# EAGLE schematic 5_8GHzRadar (EAGLE 9.5.2)

## Sheet 1 of 6
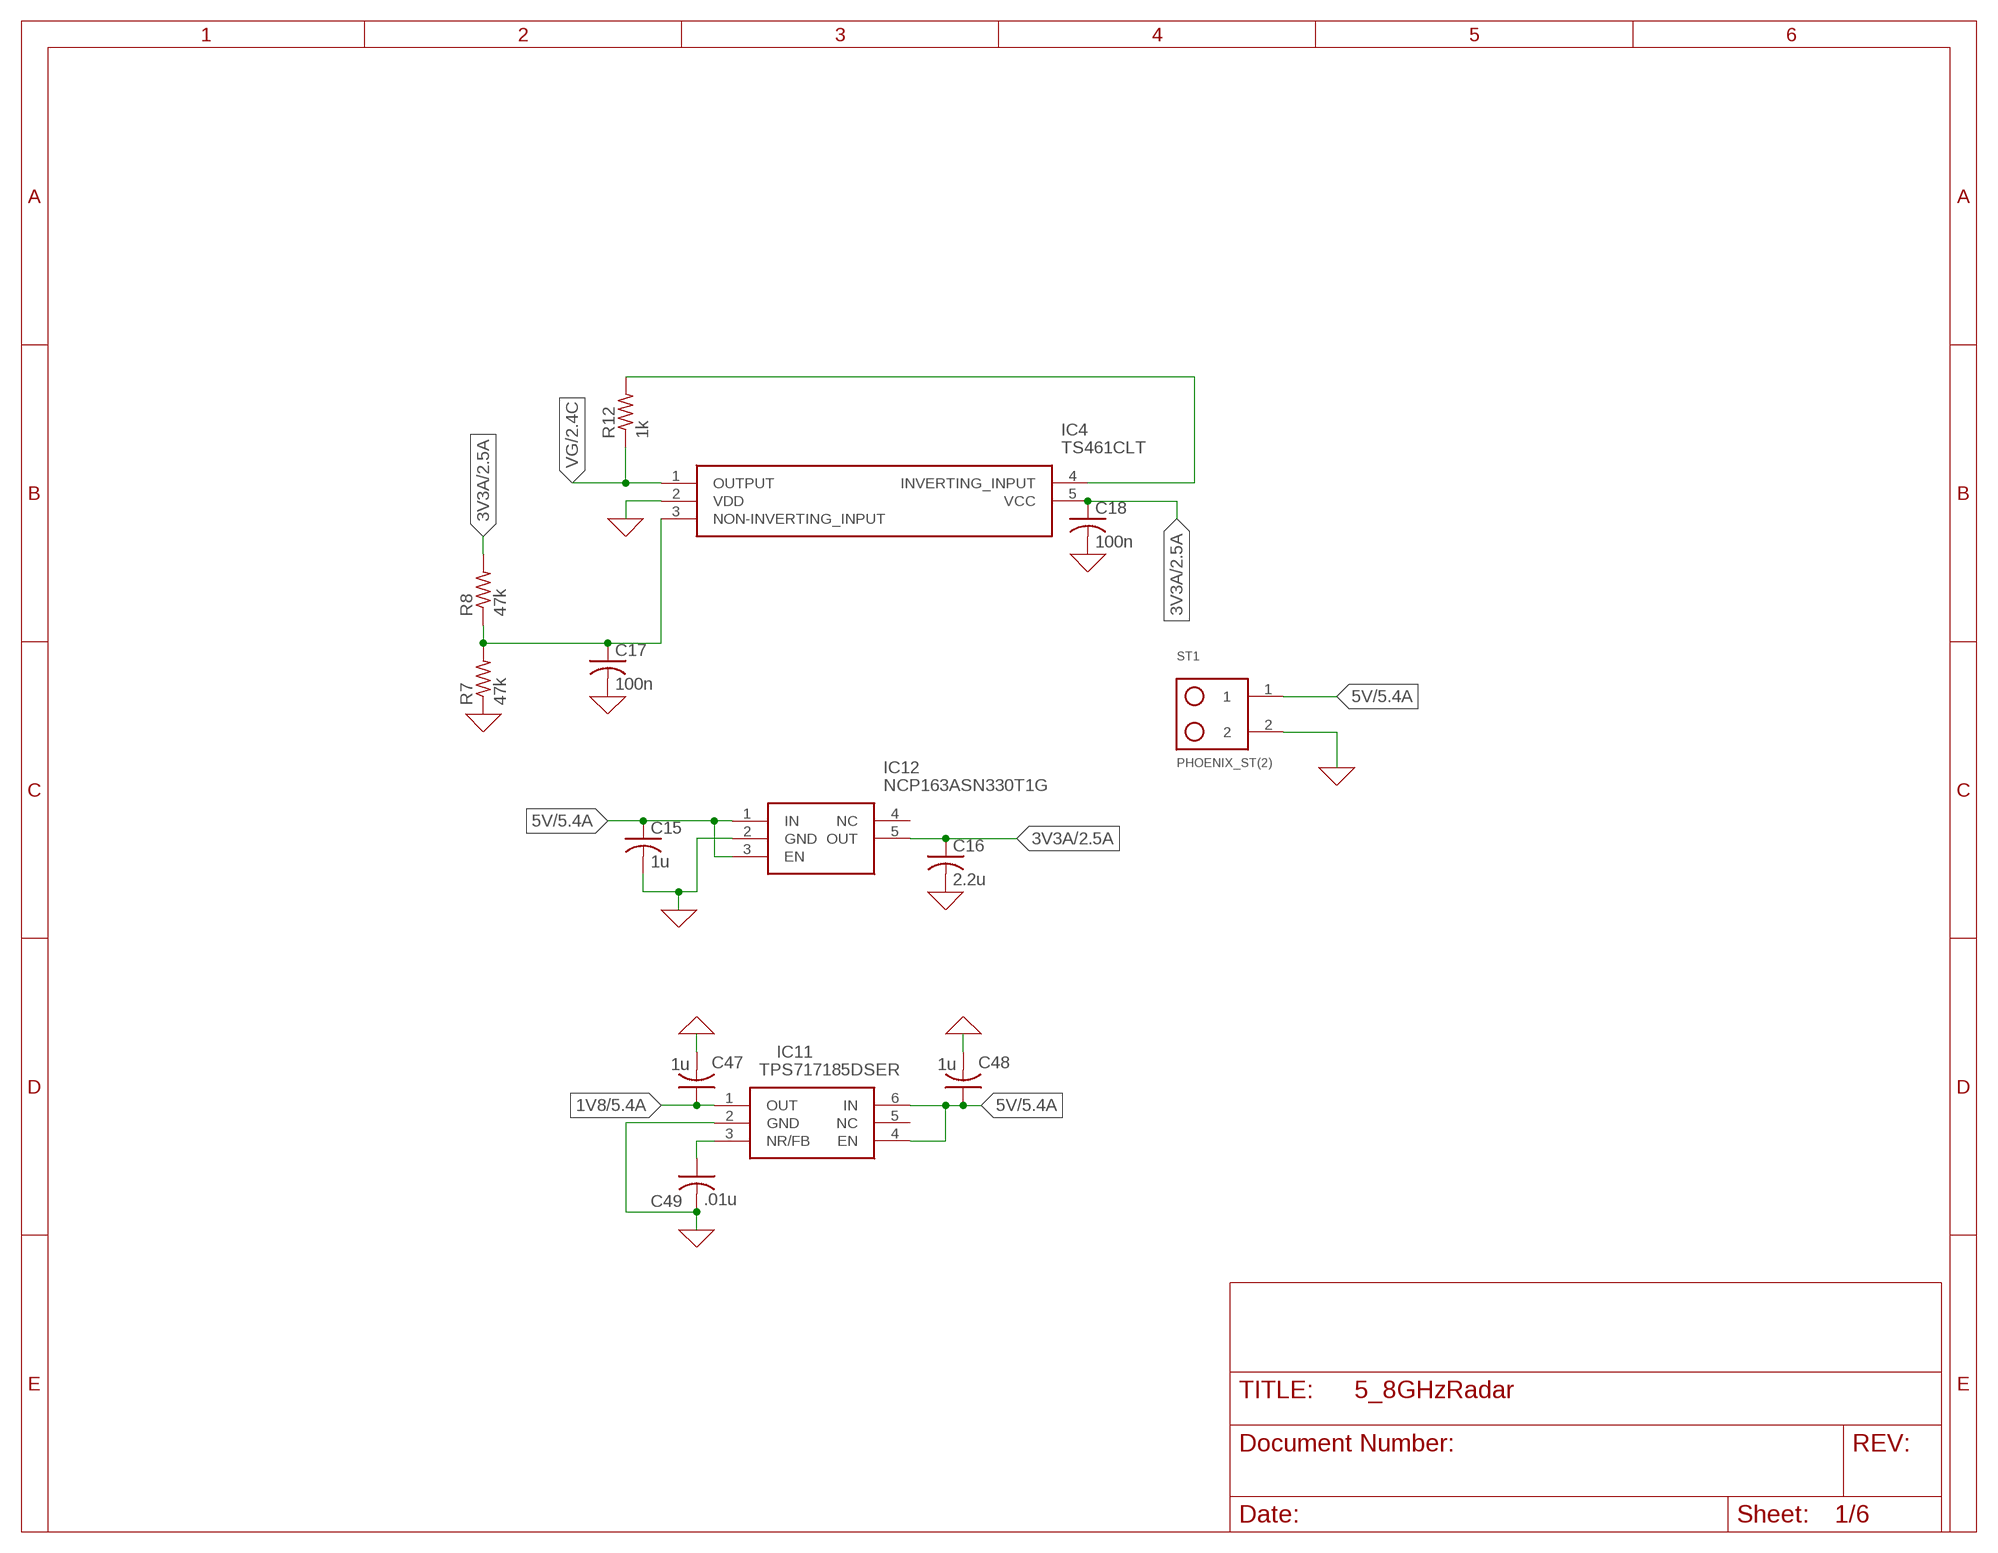
[diagram p0: schematic, sheet 1]

### Parts
C15  1u  C-USC0805  [C0805]
C16  2.2u  C-USC0805  [C0805]
C17  100n  C-USC0805  [C0805]
C18  100n  C-USC0805  [C0805]
C47  1u  C-USC0805  [C0805]
C48  1u  C-USC0805  [C0805]
C49  .01u  C-USC0805  [C0805]
IC4  TS461CLT  [SOT95P280X145-5N@1]
IC11  TPS717185DSER  [SON50P150X150X80-6N]
IC12  NCP163ASN330T1G  [SOT95P280X145-5N]
R7  47k  R-US_R0805  [R0805]
R8  47k  R-US_R0805  [R0805]
R12  1k  R-US_R0805  [R0805]
ST1  PHOENIX_ST(2)  [PHEONIX_SCREW(2)]

### Nets
0: C15.2 C16.2 C17.2 C18.2 C47.2 C48.2 C49.2 IC4.2(VDD) IC11.2(GND) IC12.2(GND) R7.1 ST1.2 ; supply symbol labelled GND ; also sheet 2,3,4,5
1V8: C47.1 IC11.1(OUT) ; also sheet 5
3V3A: C16.1 C18.1 IC4.5(VCC) IC12.5(OUT) R8.2 ; also sheet 2,3,4,5
5V: C15.1 C48.1 IC11.4(EN) IC11.6(IN) IC12.1(IN) IC12.3(EN) ST1.1 ; also sheet 5
N$8: C17.1 IC4.3(NON-INVERTING_INPUT) R7.2 R8.1
N$17: IC4.4(INVERTING_INPUT) R12.2
N$46: C49.1 IC11.3(NR/FB)
VG: IC4.1(OUTPUT) R12.1 ; also sheet 2,3,4
Unconnected: IC11.5(NC) IC12.4(NC)

## Sheet 2 of 6
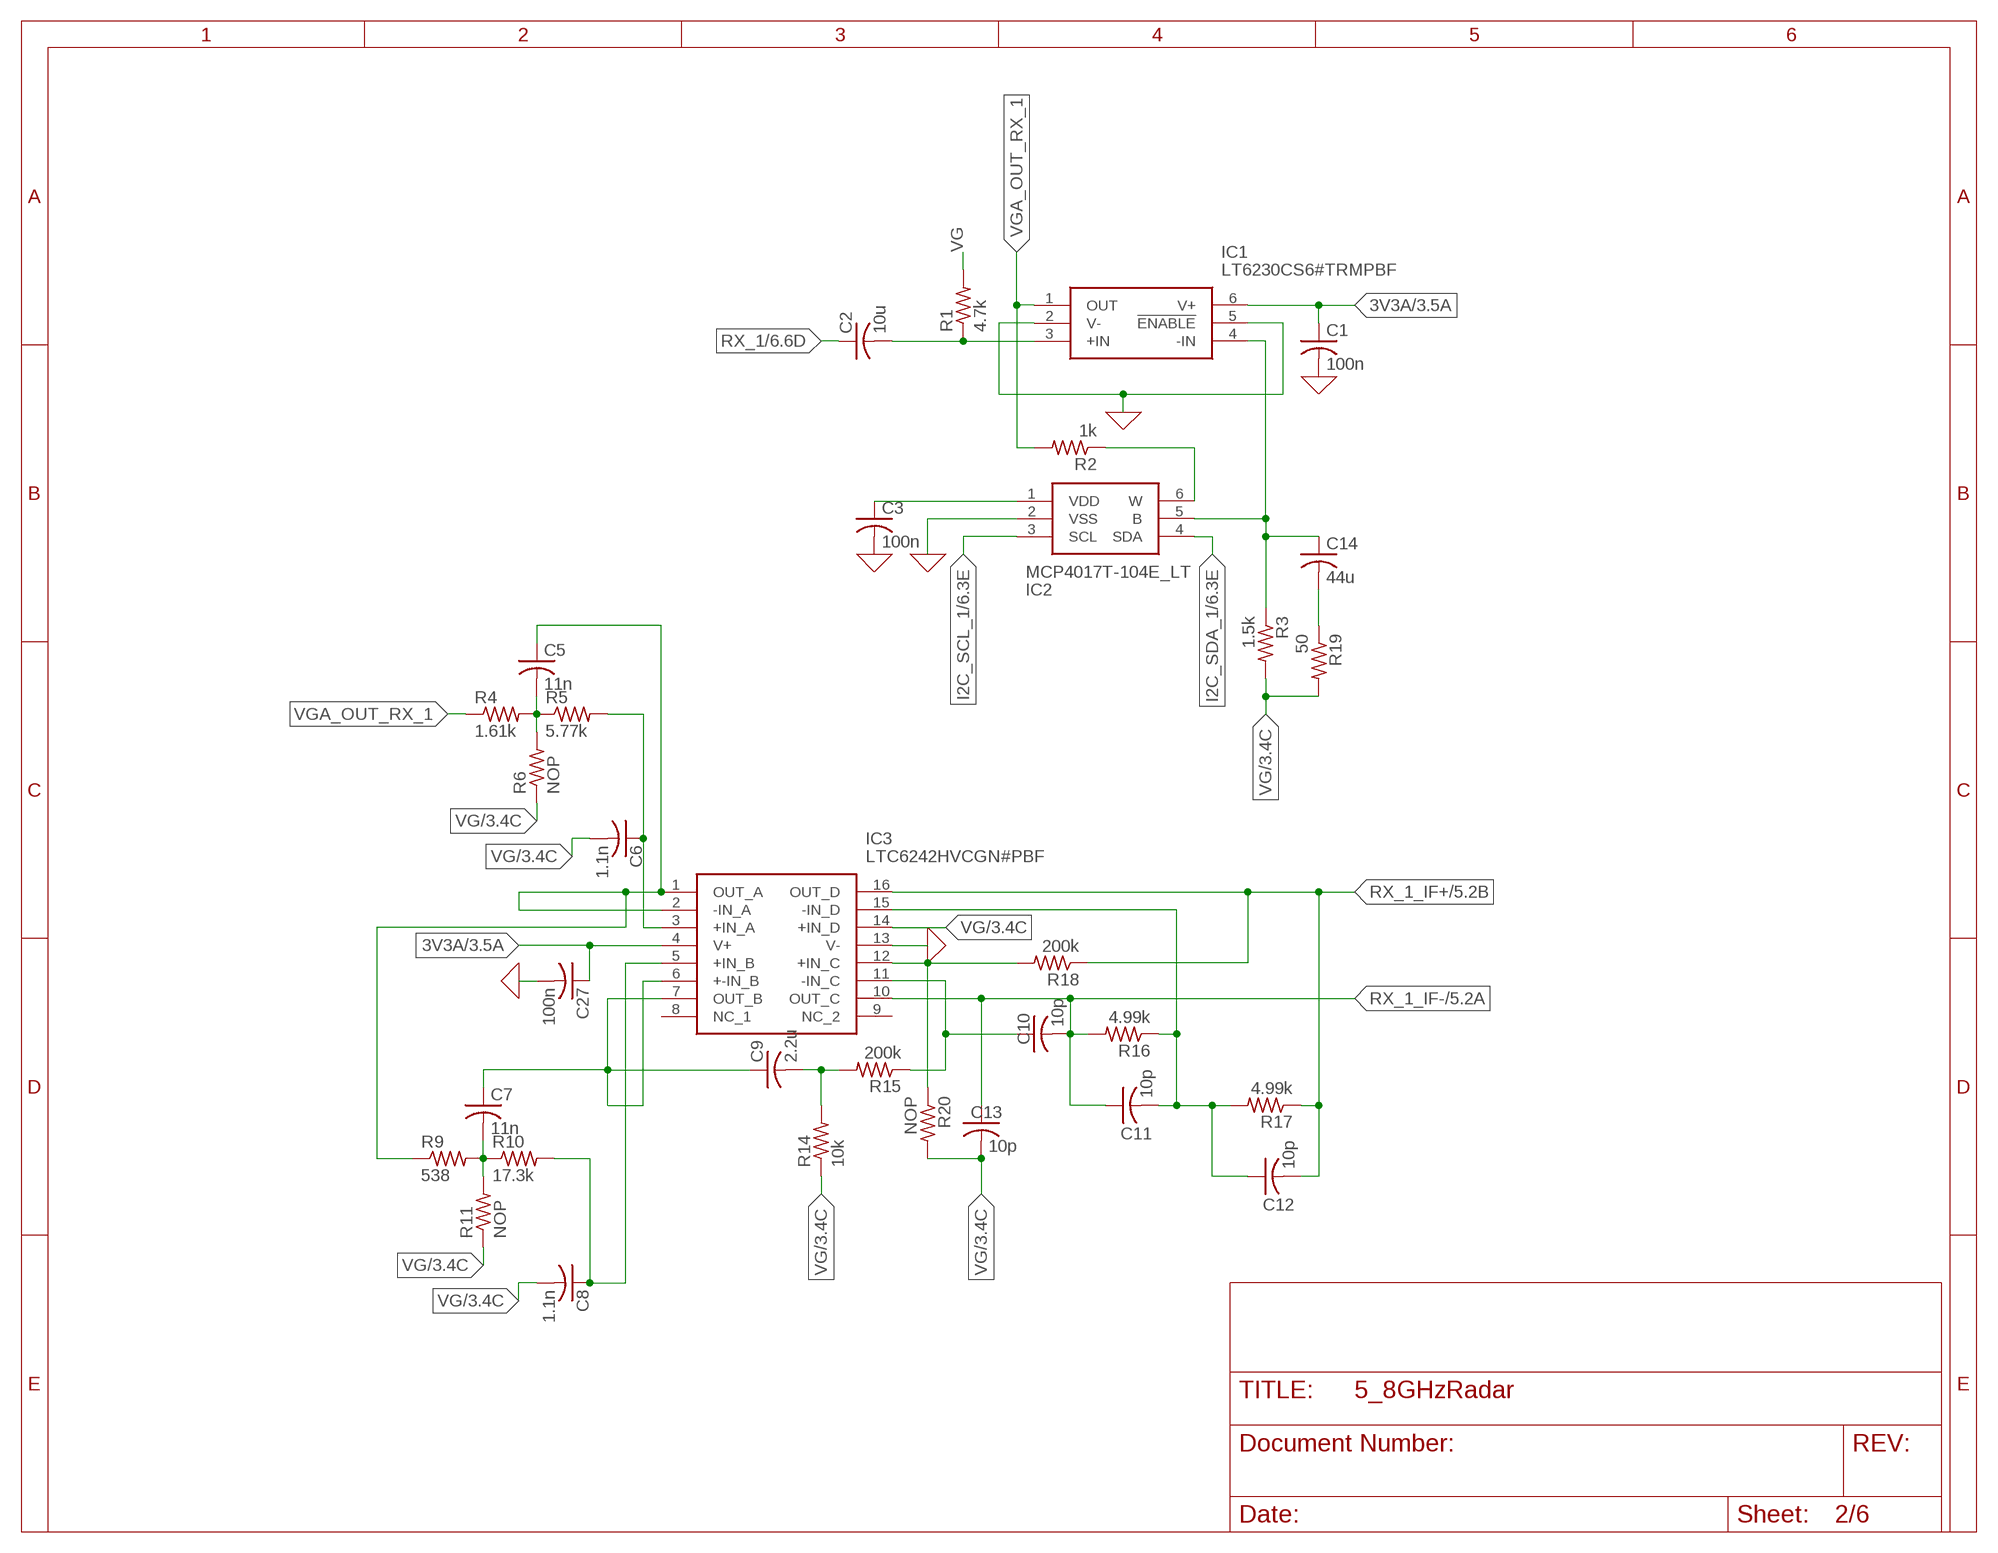
[diagram p1: schematic, sheet 2]

### Parts
C1  100n  C-USC0805  [C0805]
C2  10u  C-USC0805  [C0805]
C3  100n  C-USC0805  [C0805]
C5  11n  C-USC0805  [C0805]
C6  1.1n  C-USC0805  [C0805]
C7  11n  C-USC0805  [C0805]
C8  1.1n  C-USC0805  [C0805]
C9  2.2u  C-USC0805  [C0805]
C10  10p  C-USC0805  [C0805]
C11  10p  C-USC0805  [C0805]
C12  10p  C-USC0805  [C0805]
C13  10p  C-USC0805  [C0805]
C14  44u  C-USC0603  [C0603]
C27  100n  C-USC0805  [C0805]
IC1  LT6230CS6#TRMPBF  [SOT95P280X100-6N]
IC2  MCP4017T-104E_LT  [SOT65P210X110-6N]
IC3  LTC6242HVCGN#PBF  [SOP64P601X175-16N]
R1  4.7k  R-US_R0805  [R0805]
R2  1k  R-US_R0805  [R0805]
R3  1.5k  R-US_R0805  [R0805]
R4  1.61k  R-US_R0805  [R0805]
R5  5.77k  R-US_R0805  [R0805]
R6  NOP  R-US_R0805  [R0805]
R9  538  R-US_R0805  [R0805]
R10  17.3k  R-US_R0805  [R0805]
R11  NOP  R-US_R0805  [R0805]
R14  10k  R-US_R0805  [R0805]
R15  200k  R-US_R0805  [R0805]
R16  4.99k  R-US_R0805  [R0805]
R17  4.99k  R-US_R0805  [R0805]
R18  200k  R-US_R0805  [R0805]
R19  50  R-US_R0805  [R0805]
R20  NOP  R-US_R0805  [R0805]

### Nets
0: C1.2 C3.2 C27.2 IC1.2(V-) IC1.5(!ENABLE) IC2.2(VSS) IC3.13(V-) ; supply symbol labelled GND ; also sheet 1,3,4,5
3V3A: C1.1 C27.1 IC1.6(V+) IC3.4(V+) ; also sheet 1,3,4,5
FILTER1: C5.1 IC3.1(OUT_A) IC3.2(-IN_A) R9.1
I2C_SCL_1: IC2.3(SCL) ; also sheet 6
I2C_SDA_1: IC2.4(SDA) ; also sheet 6
N$1: C14.1 IC1.4(-IN) IC2.5(B) R3.1
N$2: C2.2 IC1.3(+IN) R1.1
N$3: C5.2 R4.2 R5.1 R6.2
N$4: IC2.6(W) R2.1
N$5: C3.1 IC2.1(VDD)
N$6: C9.2 R14.2 R15.2
N$7: C6.1 IC3.3(+IN_A) R5.2
N$9: C7.2 R9.2 R10.1 R11.2
N$11: C8.1 IC3.5(+IN_B) R10.2
N$12: C7.1 C9.1 IC3.6(+-IN_B) IC3.7(OUT_B)
N$13: C10.1 IC3.11(-IN_C) R15.1
N$14: C14.2 R19.1
N$15: IC3.12(+IN_C) R18.2 R20.1
N$18: C11.2 C12.1 IC3.15(-IN_D) R16.1 R17.2
RX_1: C2.1 ; also sheet 6
RX_1_IF+: C12.2 IC3.16(OUT_D) R17.1 R18.1 ; also sheet 5,6
RX_1_IF-: C10.2 C11.1 C13.1 IC3.10(OUT_C) R16.2 ; also sheet 5,6
VG: C6.2 C8.2 C13.2 IC3.14(+IN_D) R1.2 R3.2 R6.1 R11.1 R14.1 R19.2 R20.2 ; also sheet 1,3,4
VGA_OUT_RX_1: IC1.1(OUT) R2.2 R4.1
Unconnected: IC3.8(NC_1) IC3.9(NC_2)

## Sheet 3 of 6
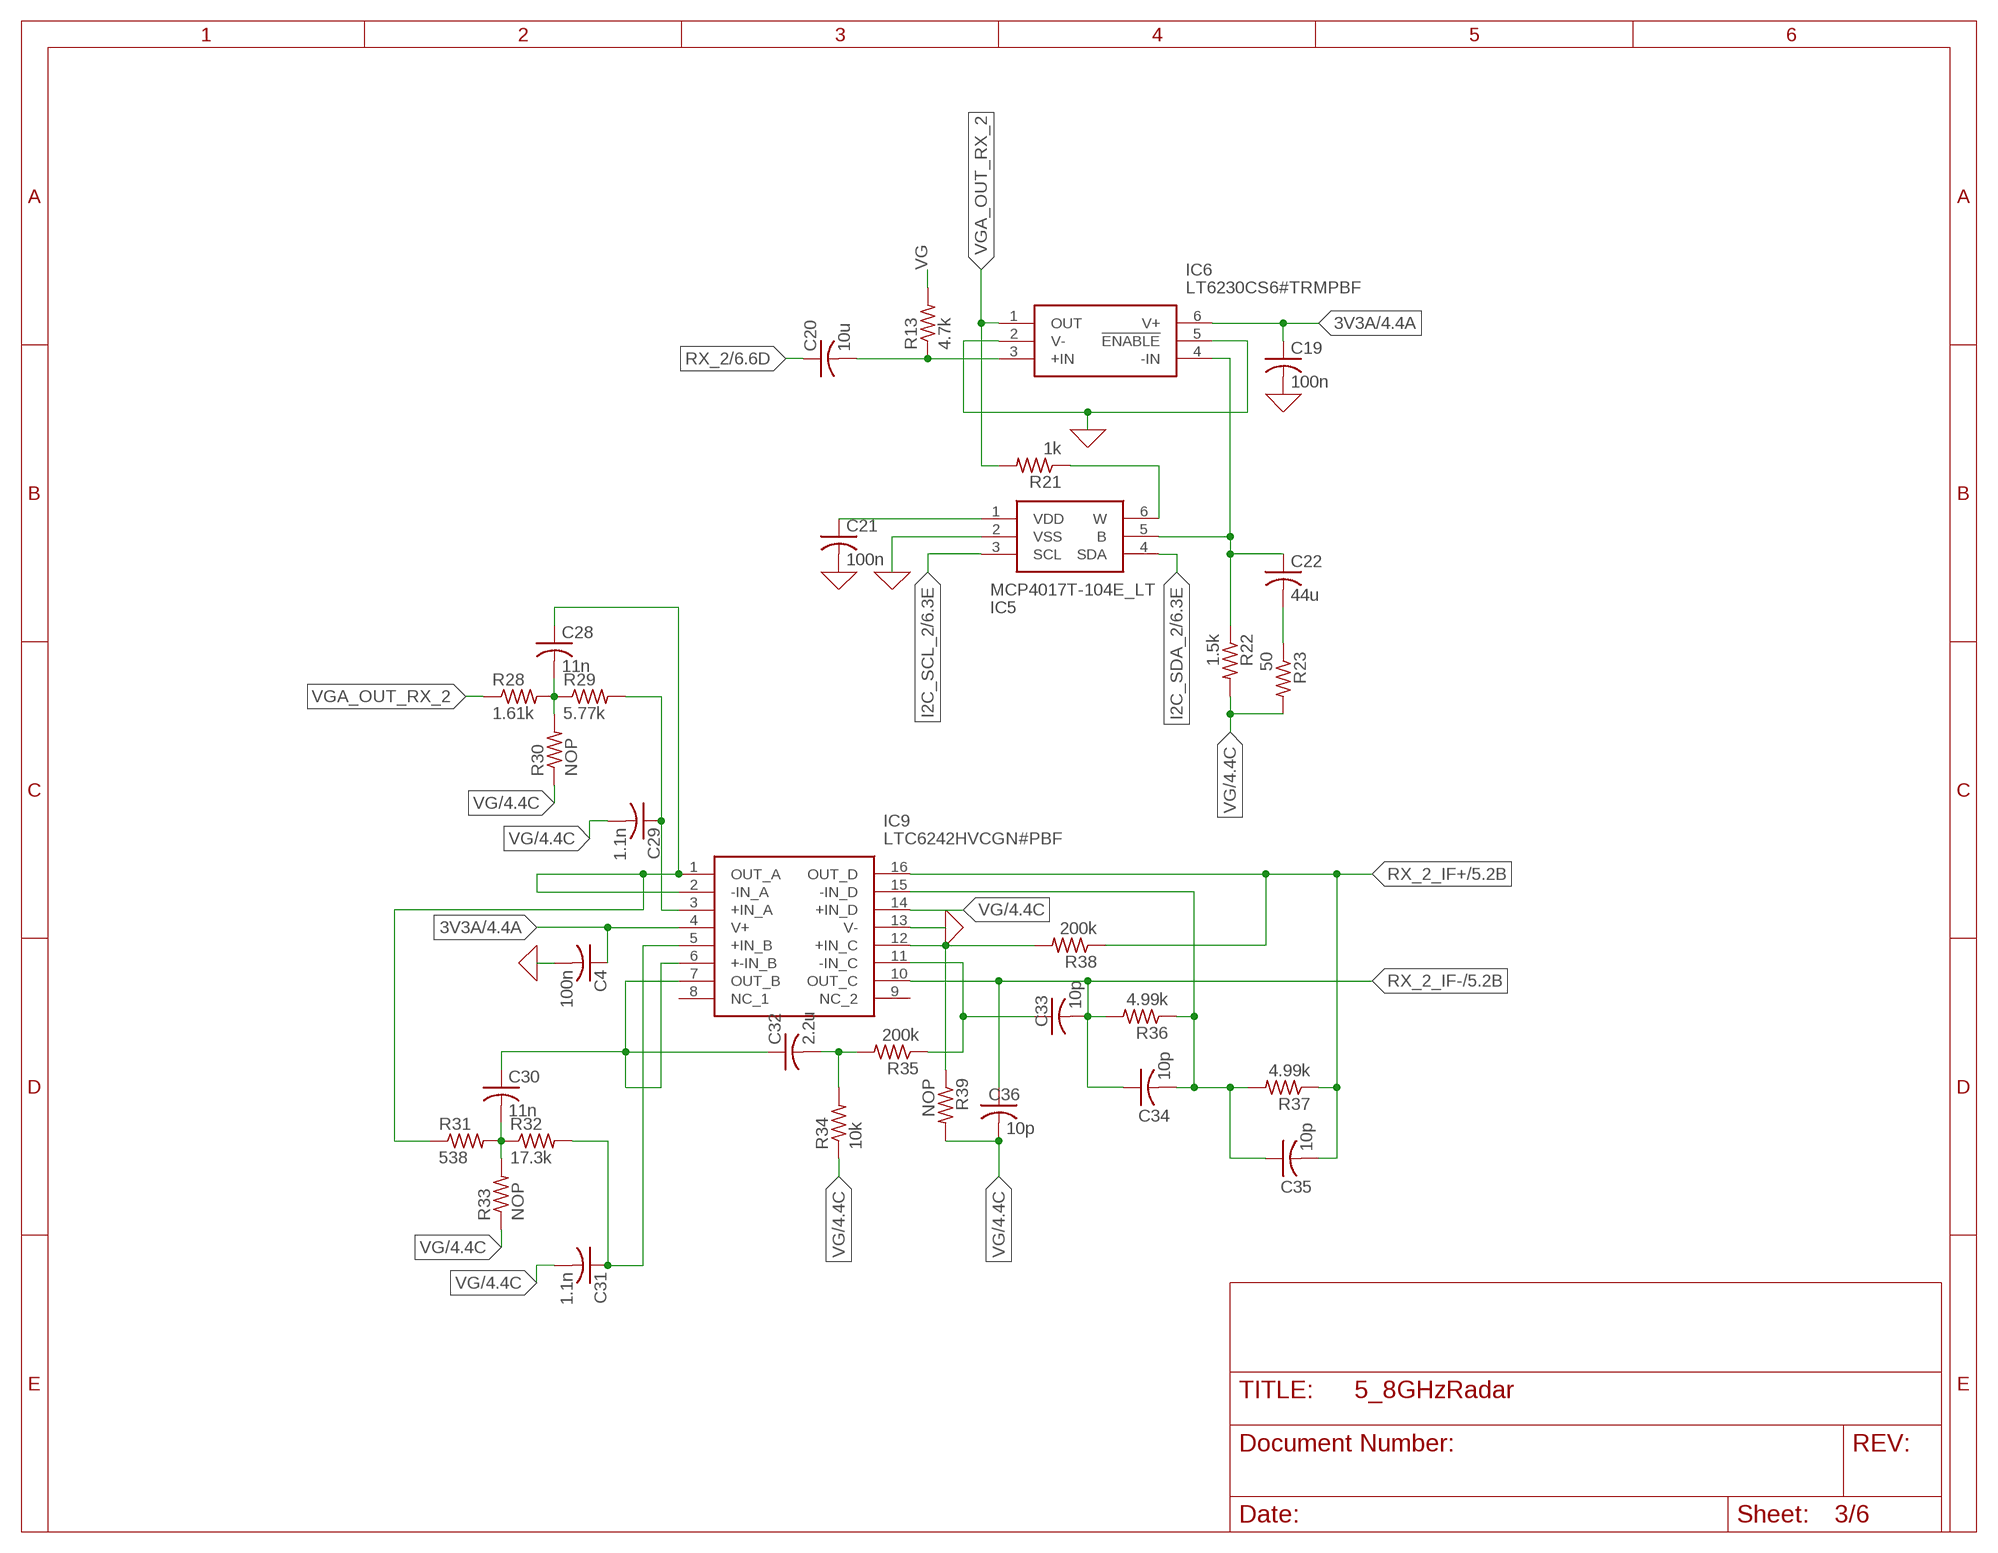
[diagram p2: schematic, sheet 3]

### Parts
C4  100n  C-USC0805  [C0805]
C19  100n  C-USC0805  [C0805]
C20  10u  C-USC0805  [C0805]
C21  100n  C-USC0805  [C0805]
C22  44u  C-USC0805  [C0805]
C28  11n  C-USC0805  [C0805]
C29  1.1n  C-USC0805  [C0805]
C30  11n  C-USC0805  [C0805]
C31  1.1n  C-USC0805  [C0805]
C32  2.2u  C-USC0805  [C0805]
C33  10p  C-USC0805  [C0805]
C34  10p  C-USC0805  [C0805]
C35  10p  C-USC0805  [C0805]
C36  10p  C-USC0805  [C0805]
IC5  MCP4017T-104E_LT  [SOT65P210X110-6N]
IC6  LT6230CS6#TRMPBF  [SOT95P280X100-6N]
IC9  LTC6242HVCGN#PBF  [SOP64P601X175-16N]
R13  4.7k  R-US_R0805  [R0805]
R21  1k  R-US_R0805  [R0805]
R22  1.5k  R-US_R0805  [R0805]
R23  50  R-US_R0805  [R0805]
R28  1.61k  R-US_R0805  [R0805]
R29  5.77k  R-US_R0805  [R0805]
R30  NOP  R-US_R0805  [R0805]
R31  538  R-US_R0805  [R0805]
R32  17.3k  R-US_R0805  [R0805]
R33  NOP  R-US_R0805  [R0805]
R34  10k  R-US_R0805  [R0805]
R35  200k  R-US_R0805  [R0805]
R36  4.99k  R-US_R0805  [R0805]
R37  4.99k  R-US_R0805  [R0805]
R38  200k  R-US_R0805  [R0805]
R39  NOP  R-US_R0805  [R0805]

### Nets
0: C4.2 C19.2 C21.2 IC5.2(VSS) IC6.2(V-) IC6.5(!ENABLE) IC9.13(V-) ; supply symbol labelled GND ; also sheet 1,2,4,5
3V3A: C4.1 C19.1 IC6.6(V+) IC9.4(V+) ; also sheet 1,2,4,5
FILTER2: C28.1 IC9.1(OUT_A) IC9.2(-IN_A) R31.1
I2C_SCL_2: IC5.3(SCL) ; also sheet 6
I2C_SDA_2: IC5.4(SDA) ; also sheet 6
N$10: C22.1 IC5.5(B) IC6.4(-IN) R22.1
N$16: C20.2 IC6.3(+IN) R13.1
N$19: IC5.6(W) R21.1
N$20: C21.1 IC5.1(VDD)
N$21: C22.2 R23.1
N$27: C28.2 R28.2 R29.1 R30.2
N$28: C29.1 IC9.3(+IN_A) R29.2
N$29: C30.2 R31.2 R32.1 R33.2
N$30: C31.1 IC9.5(+IN_B) R32.2
N$31: C30.1 C32.1 IC9.6(+-IN_B) IC9.7(OUT_B)
N$32: C32.2 R34.2 R35.2
N$33: C33.1 IC9.11(-IN_C) R35.1
N$34: C34.2 C35.1 IC9.15(-IN_D) R36.1 R37.2
N$35: IC9.12(+IN_C) R38.2 R39.1
RX_2: C20.1 ; also sheet 6
RX_2_IF+: C35.2 IC9.16(OUT_D) R37.1 R38.1 ; also sheet 5,6
RX_2_IF-: C33.2 C34.1 C36.1 IC9.10(OUT_C) R36.2 ; also sheet 5,6
VG: C29.2 C31.2 C36.2 IC9.14(+IN_D) R13.2 R22.2 R23.2 R30.1 R33.1 R34.1 R39.2 ; also sheet 1,2,4
VGA_OUT_RX_2: IC6.1(OUT) R21.2 R28.1
Unconnected: IC9.8(NC_1) IC9.9(NC_2)

## Sheet 4 of 6
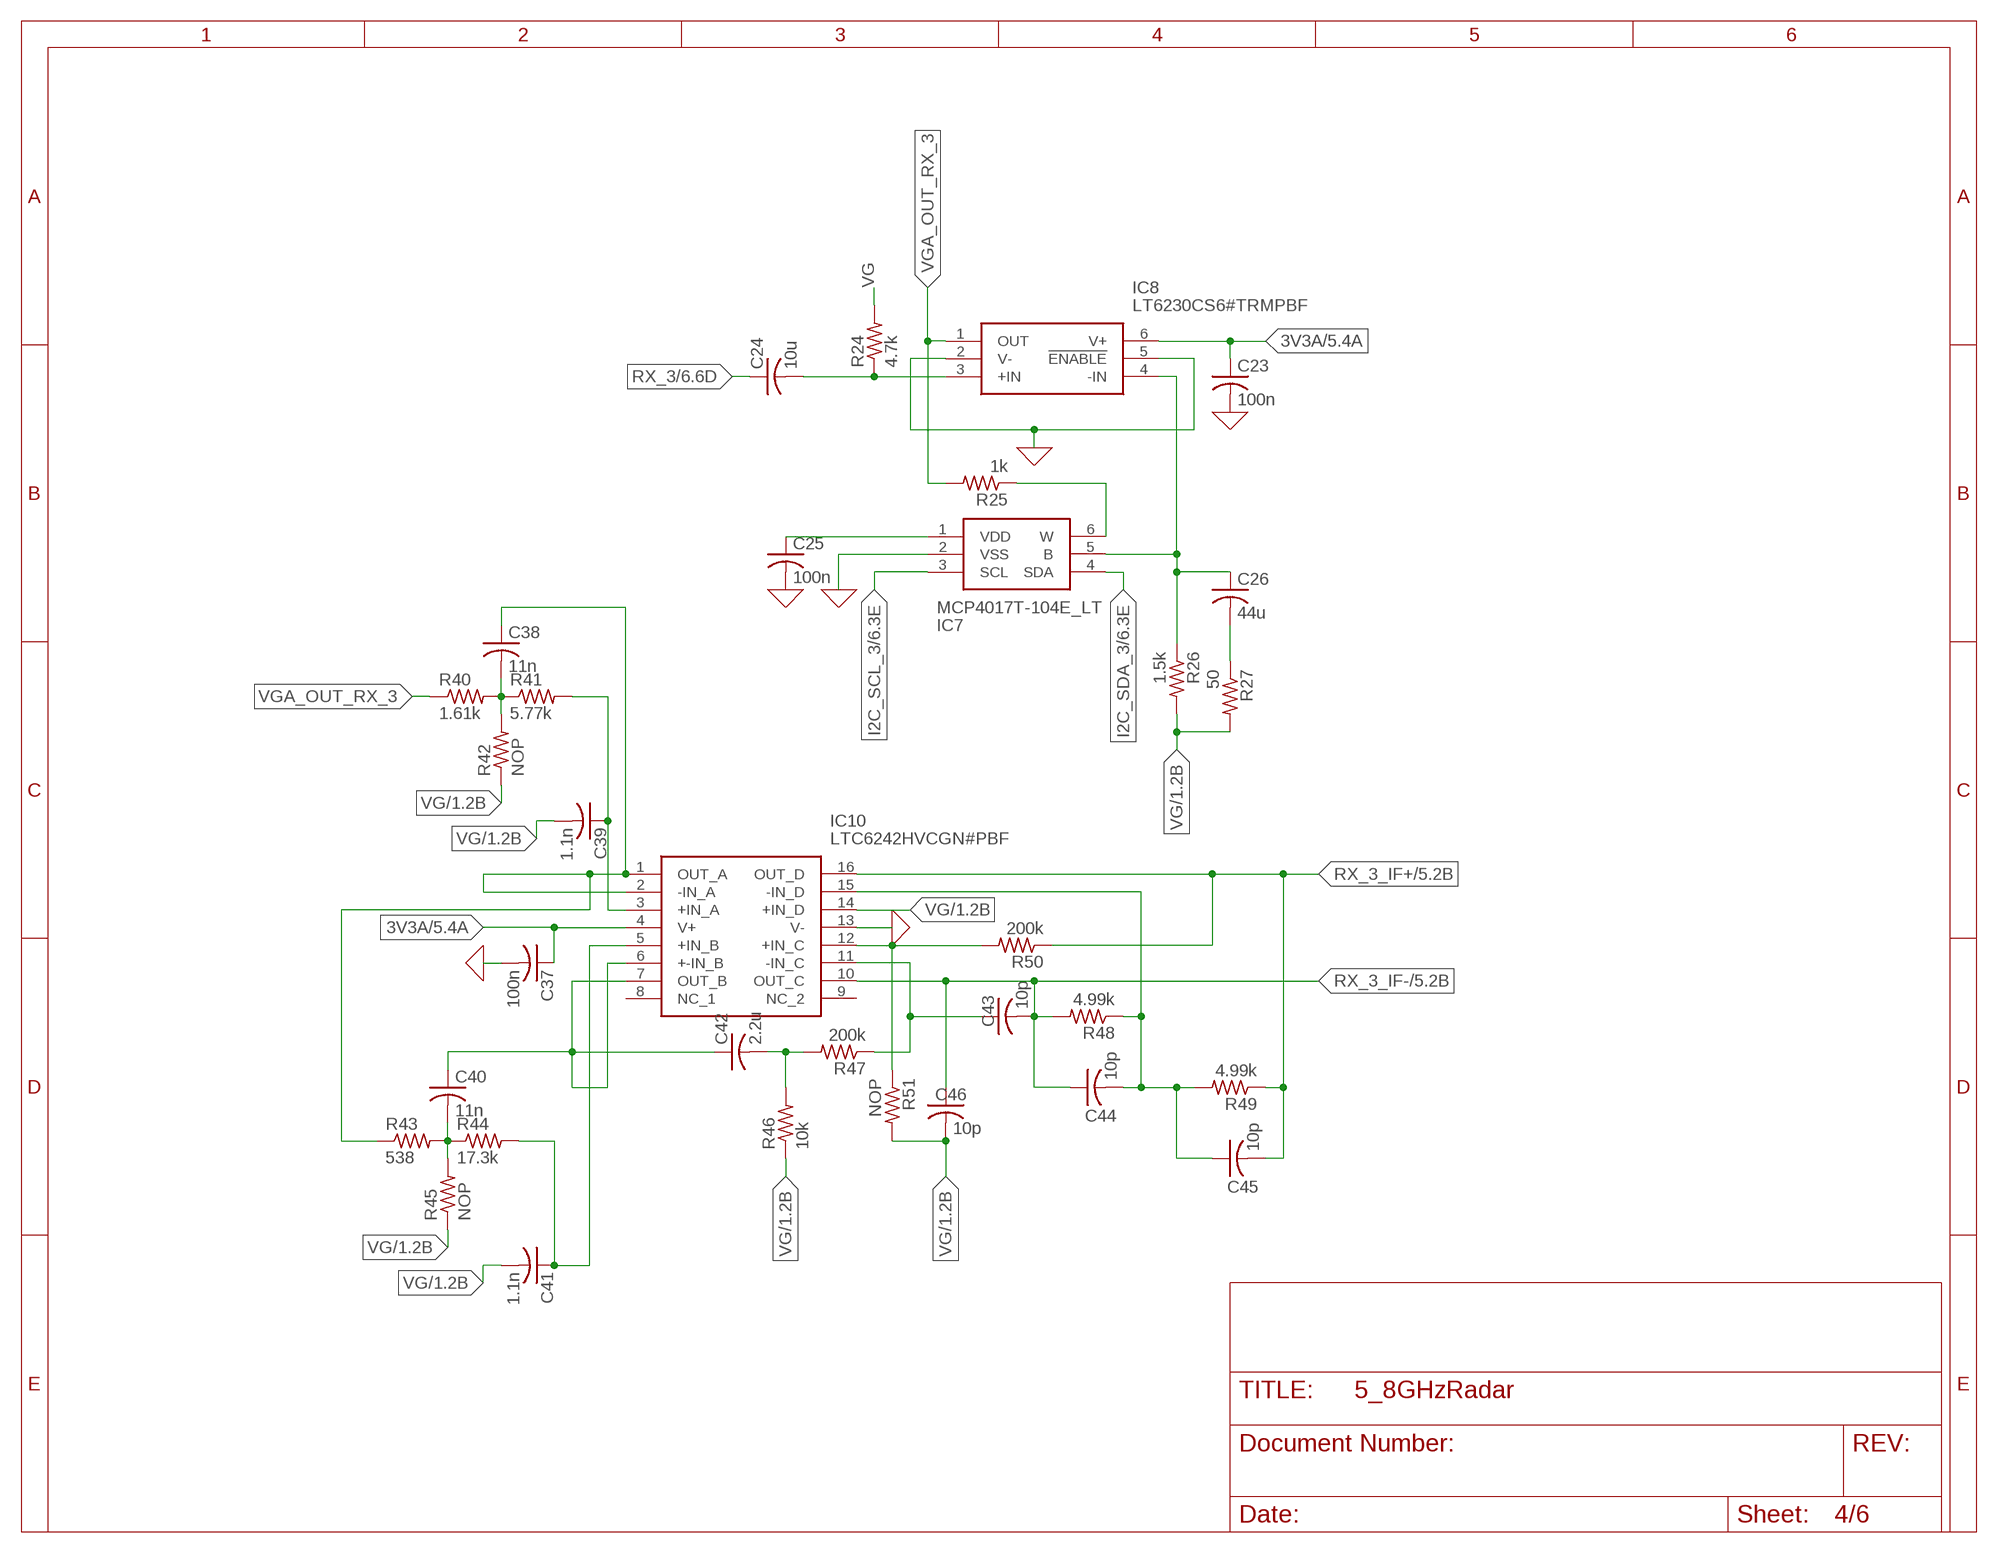
[diagram p3: schematic, sheet 4]

### Parts
C23  100n  C-USC0805  [C0805]
C24  10u  C-USC0805  [C0805]
C25  100n  C-USC0805  [C0805]
C26  44u  C-USC0805  [C0805]
C37  100n  C-USC0805  [C0805]
C38  11n  C-USC0805  [C0805]
C39  1.1n  C-USC0805  [C0805]
C40  11n  C-USC0805  [C0805]
C41  1.1n  C-USC0805  [C0805]
C42  2.2u  C-USC0805  [C0805]
C43  10p  C-USC0805  [C0805]
C44  10p  C-USC0805  [C0805]
C45  10p  C-USC0805  [C0805]
C46  10p  C-USC0805  [C0805]
IC7  MCP4017T-104E_LT  [SOT65P210X110-6N]
IC8  LT6230CS6#TRMPBF  [SOT95P280X100-6N]
IC10  LTC6242HVCGN#PBF  [SOP64P601X175-16N]
R24  4.7k  R-US_R0805  [R0805]
R25  1k  R-US_R0805  [R0805]
R26  1.5k  R-US_R0805  [R0805]
R27  50  R-US_R0805  [R0805]
R40  1.61k  R-US_R0805  [R0805]
R41  5.77k  R-US_R0805  [R0805]
R42  NOP  R-US_R0805  [R0805]
R43  538  R-US_R0805  [R0805]
R44  17.3k  R-US_R0805  [R0805]
R45  NOP  R-US_R0805  [R0805]
R46  10k  R-US_R0805  [R0805]
R47  200k  R-US_R0805  [R0805]
R48  4.99k  R-US_R0805  [R0805]
R49  4.99k  R-US_R0805  [R0805]
R50  200k  R-US_R0805  [R0805]
R51  NOP  R-US_R0805  [R0805]

### Nets
0: C23.2 C25.2 C37.2 IC7.2(VSS) IC8.2(V-) IC8.5(!ENABLE) IC10.13(V-) ; supply symbol labelled GND ; also sheet 1,2,3,5
3V3A: C23.1 C37.1 IC8.6(V+) IC10.4(V+) ; also sheet 1,2,3,5
FILTER3: C38.1 IC10.1(OUT_A) IC10.2(-IN_A) R43.1
I2C_SCL_3: IC7.3(SCL) ; also sheet 6
I2C_SDA_3: IC7.4(SDA) ; also sheet 6
N$22: C26.1 IC7.5(B) IC8.4(-IN) R26.1
N$23: C24.2 IC8.3(+IN) R24.1
N$24: IC7.6(W) R25.1
N$25: C25.1 IC7.1(VDD)
N$26: C26.2 R27.1
N$36: C38.2 R40.2 R41.1 R42.2
N$37: C39.1 IC10.3(+IN_A) R41.2
N$38: C40.2 R43.2 R44.1 R45.2
N$39: C41.1 IC10.5(+IN_B) R44.2
N$40: C40.1 C42.1 IC10.6(+-IN_B) IC10.7(OUT_B)
N$41: C42.2 R46.2 R47.2
N$42: C43.1 IC10.11(-IN_C) R47.1
N$43: C44.2 C45.1 IC10.15(-IN_D) R48.1 R49.2
N$44: IC10.12(+IN_C) R50.2 R51.1
RX_3: C24.1 ; also sheet 6
RX_3_IF+: C45.2 IC10.16(OUT_D) R49.1 R50.1 ; also sheet 5,6
RX_3_IF-: C43.2 C44.1 C46.1 IC10.10(OUT_C) R48.2 ; also sheet 5,6
VG: C39.2 C41.2 C46.2 IC10.14(+IN_D) R24.2 R26.2 R27.2 R42.1 R45.1 R46.1 R51.2 ; also sheet 1,2,3
VGA_OUT_RX_3: IC8.1(OUT) R25.2 R40.1
Unconnected: IC10.8(NC_1) IC10.9(NC_2)

## Sheet 5 of 6
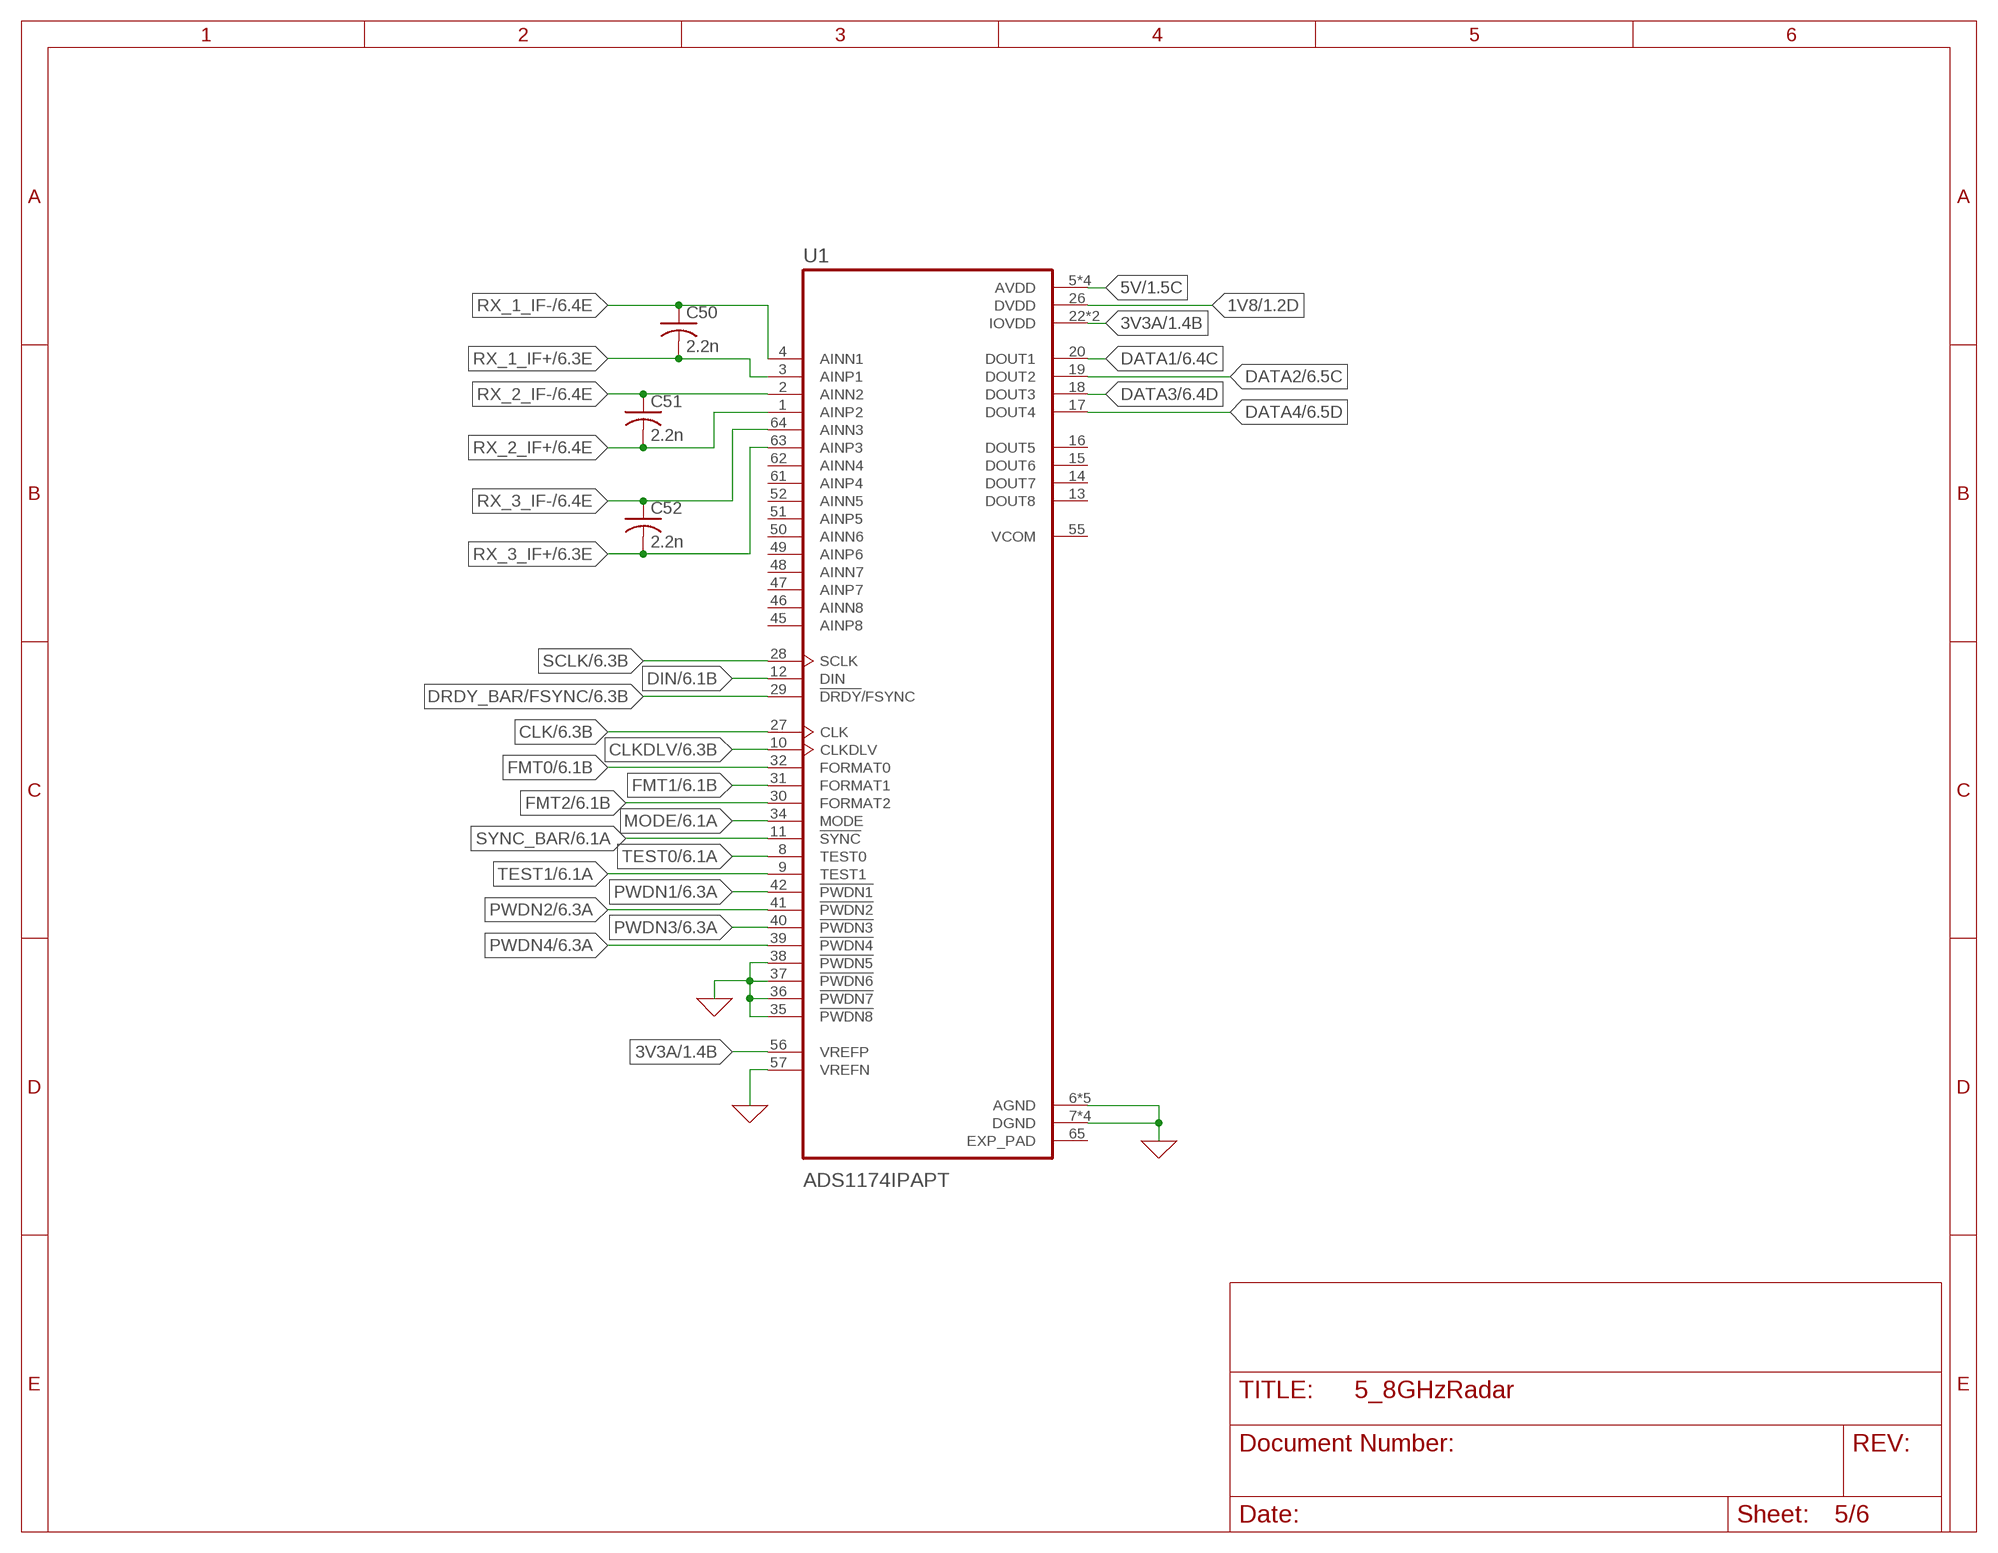
[diagram p4: schematic, sheet 5]

### Parts
C50  2.2n  C-USC0805  [C0805]
C51  2.2n  C-USC0805  [C0805]
C52  2.2n  C-USC0805  [C0805]
U1  ADS1174IPAPT  [QFP50P1200X1200X120-65N]

### Nets
0: U1.6(AGND) U1.7(DGND) U1.21(DGND) U1.24(DGND) U1.25(DGND) U1.35(!PWDN8) U1.36(!PWDN7) U1.37(!PWDN6) U1.38(!PWDN5) U1.43(AGND) U1.54(AGND) U1.57(VREFN) U1.58(AGND) U1.59(AGND) ; supply symbol labelled GND ; also sheet 1,2,3,4
1V8: U1.26(DVDD) ; also sheet 1
3V3A: U1.22(IOVDD) U1.23(IOVDD) U1.56(VREFP) ; also sheet 1,2,3,4
5V: U1.5(AVDD) U1.44(AVDD) U1.53(AVDD) U1.60(AVDD) ; also sheet 1
CLK: U1.27(CLK) ; also sheet 6
CLKDLV: U1.10(CLKDLV) ; also sheet 6
DATA1: U1.20(DOUT1) ; also sheet 6
DATA2: U1.19(DOUT2) ; also sheet 6
DATA3: U1.18(DOUT3) ; also sheet 6
DATA4: U1.17(DOUT4) ; also sheet 6
DIN: U1.12(DIN) ; also sheet 6
DRDY_BAR/FSYNC: U1.29(!DRDY!/FSYNC) ; also sheet 6
FMT0: U1.32(FORMAT0) ; also sheet 6
FMT1: U1.31(FORMAT1) ; also sheet 6
FMT2: U1.30(FORMAT2) ; also sheet 6
MODE: U1.34(MODE) ; also sheet 6
PWDN1: U1.42(!PWDN1) ; also sheet 6
PWDN2: U1.41(!PWDN2) ; also sheet 6
PWDN3: U1.40(!PWDN3) ; also sheet 6
PWDN4: U1.39(!PWDN4) ; also sheet 6
RX_1_IF+: C50.2 U1.3(AINP1) ; also sheet 2,6
RX_1_IF-: C50.1 U1.4(AINN1) ; also sheet 2,6
RX_2_IF+: C51.2 U1.1(AINP2) ; also sheet 3,6
RX_2_IF-: C51.1 U1.2(AINN2) ; also sheet 3,6
RX_3_IF+: C52.2 U1.63(AINP3) ; also sheet 4,6
RX_3_IF-: C52.1 U1.64(AINN3) ; also sheet 4,6
SCLK: U1.28(SCLK) ; also sheet 6
SYNC_BAR: U1.11(!SYNC) ; also sheet 6
TEST0: U1.8(TEST0) ; also sheet 6
TEST1: U1.9(TEST1) ; also sheet 6
Unconnected: U1.13(DOUT8) U1.14(DOUT7) U1.15(DOUT6) U1.16(DOUT5) U1.45(AINP8) U1.46(AINN8) U1.47(AINP7) U1.48(AINN7) U1.49(AINP6) U1.50(AINN6) U1.51(AINP5) U1.52(AINN5) U1.55(VCOM) U1.61(AINP4) U1.62(AINN4)

## Sheet 6 of 6
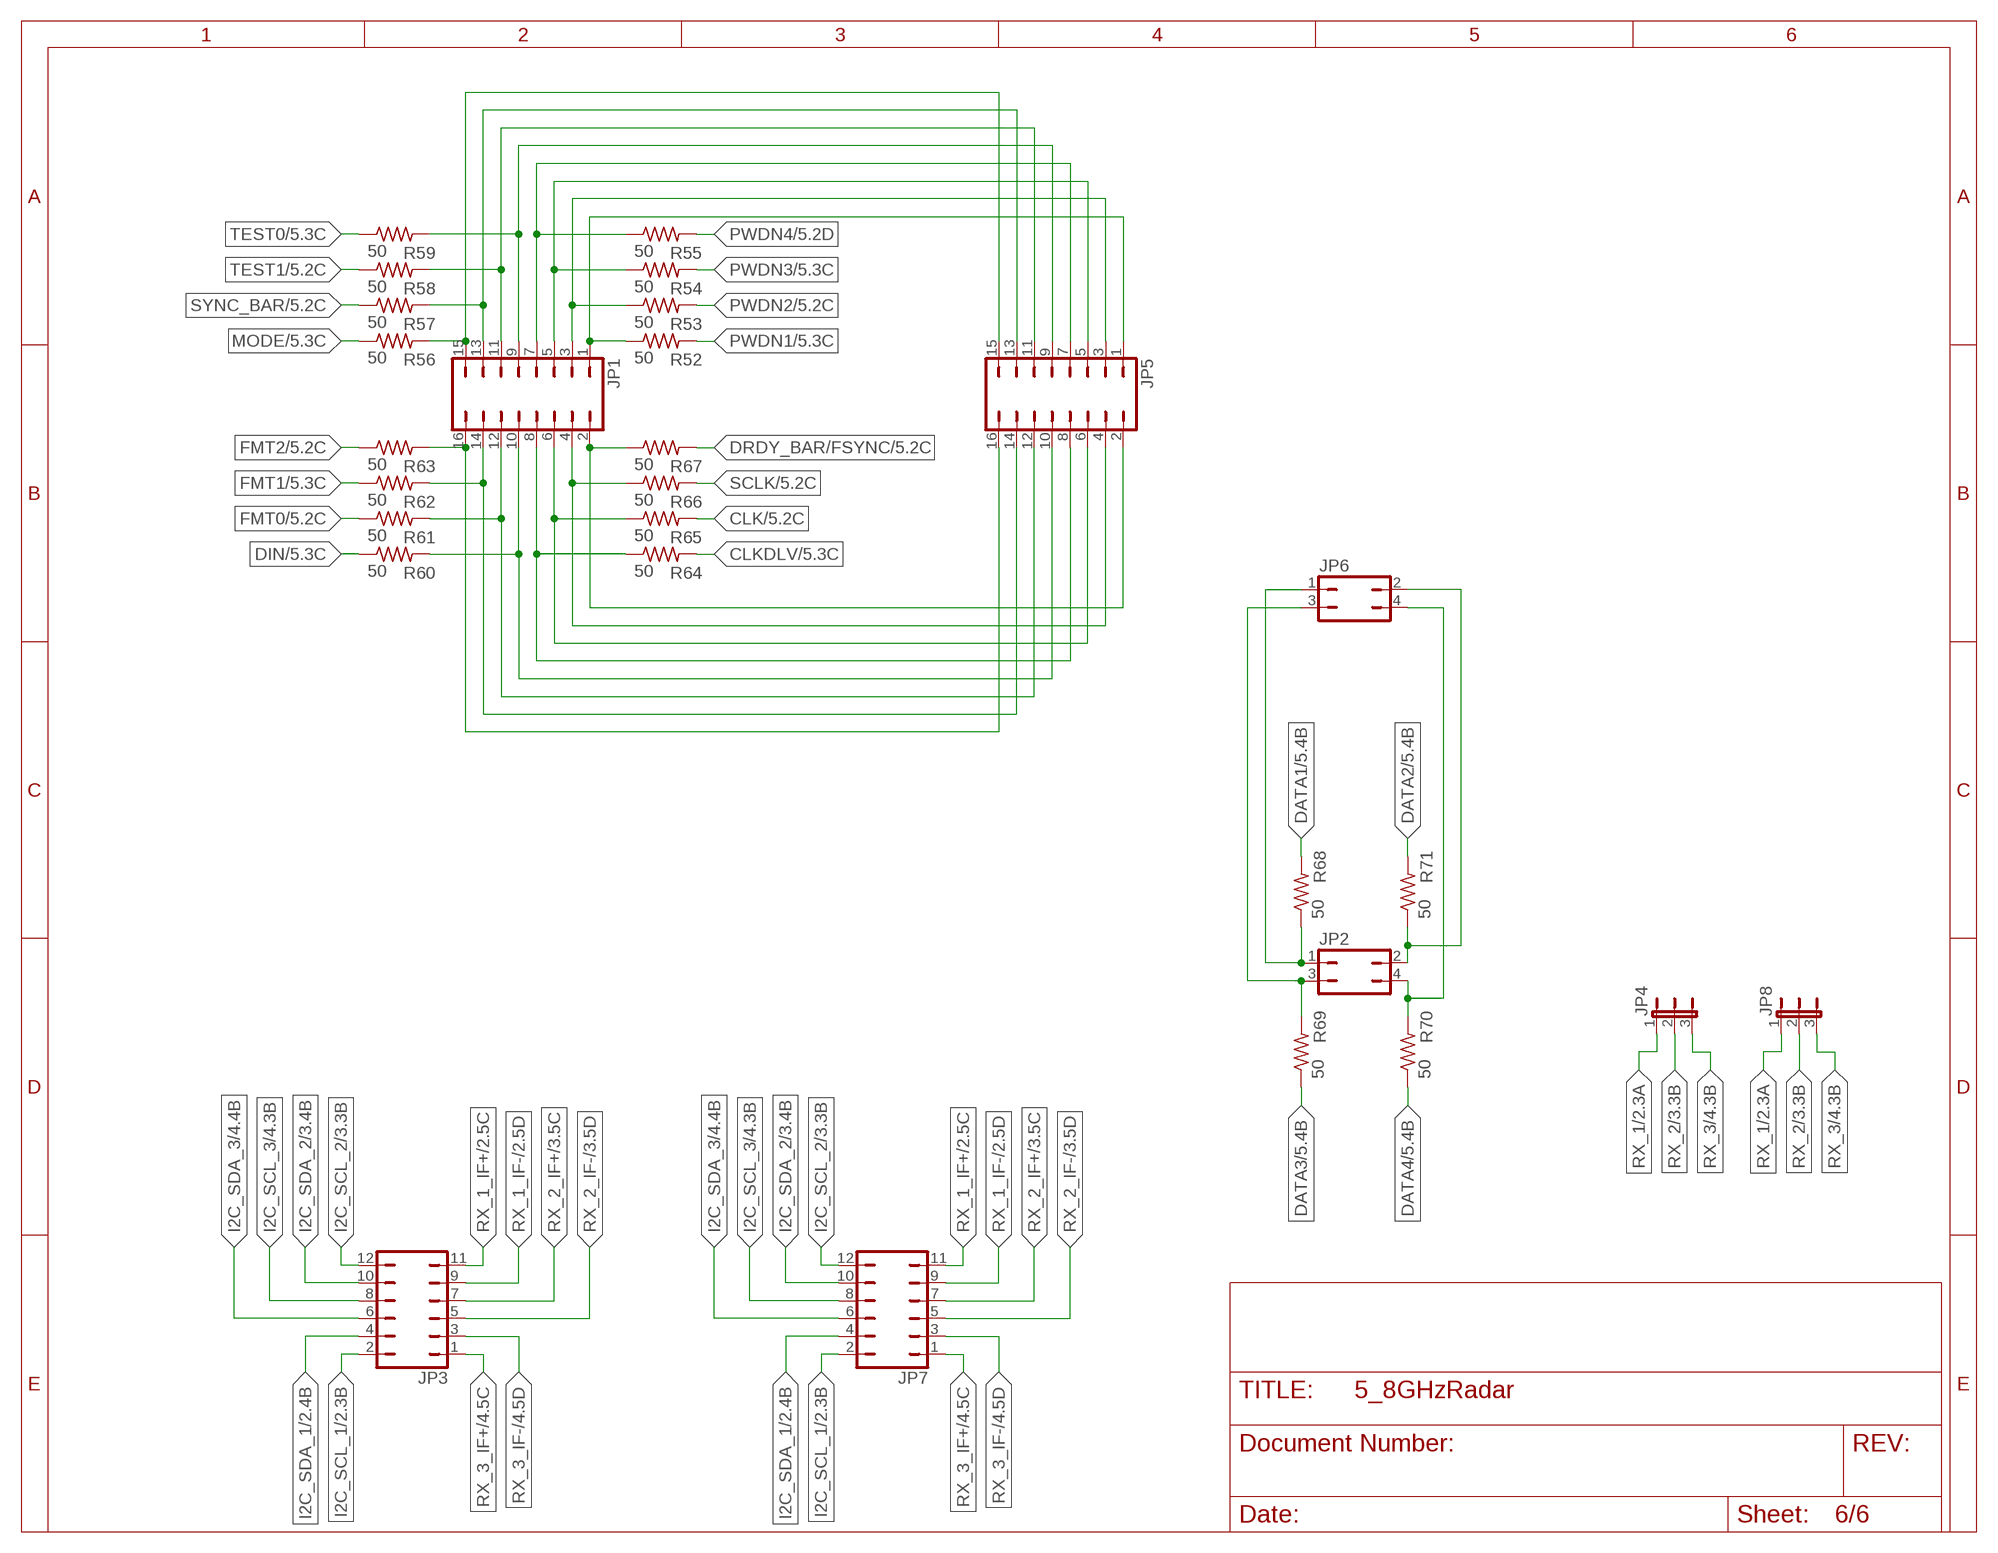
[diagram p5: schematic, sheet 6]

### Parts
JP1  JP8Q  [JP8Q]
JP2  JP2Q  [JP2Q]
JP3  JP6Q  [JP6Q]
JP4  JP2E  [JP2]
JP5  JP8Q  [JP8Q]
JP6  JP2Q  [JP2Q]
JP7  JP6Q  [JP6Q]
JP8  JP2E  [JP2]
R52  50  R-US_R0805  [R0805]
R53  50  R-US_R0805  [R0805]
R54  50  R-US_R0805  [R0805]
R55  50  R-US_R0805  [R0805]
R56  50  R-US_R0805  [R0805]
R57  50  R-US_R0805  [R0805]
R58  50  R-US_R0805  [R0805]
R59  50  R-US_R0805  [R0805]
R60  50  R-US_R0805  [R0805]
R61  50  R-US_R0805  [R0805]
R62  50  R-US_R0805  [R0805]
R63  50  R-US_R0805  [R0805]
R64  50  R-US_R0805  [R0805]
R65  50  R-US_R0805  [R0805]
R66  50  R-US_R0805  [R0805]
R67  50  R-US_R0805  [R0805]
R68  50  R-US_R0805  [R0805]
R69  50  R-US_R0805  [R0805]
R70  50  R-US_R0805  [R0805]
R71  50  R-US_R0805  [R0805]

### Nets
CLK: R65.2 ; also sheet 5
CLKDLV: R64.2 ; also sheet 5
DATA1: R68.2 ; also sheet 5
DATA2: R71.2 ; also sheet 5
DATA3: R69.1 ; also sheet 5
DATA4: R70.1 ; also sheet 5
DIN: R60.1 ; also sheet 5
DRDY_BAR/FSYNC: R67.2 ; also sheet 5
FMT0: R61.1 ; also sheet 5
FMT1: R62.1 ; also sheet 5
FMT2: R63.1 ; also sheet 5
I2C_SCL_1: JP3.2 JP7.2 ; also sheet 2
I2C_SCL_2: JP3.12 JP7.12 ; also sheet 3
I2C_SCL_3: JP3.8 JP7.8 ; also sheet 4
I2C_SDA_1: JP3.4 JP7.4 ; also sheet 2
I2C_SDA_2: JP3.10 JP7.10 ; also sheet 3
I2C_SDA_3: JP3.6 JP7.6 ; also sheet 4
MODE: R56.1 ; also sheet 5
N$45: JP1.1 JP5.1 R52.1
N$47: JP1.3 JP5.3 R53.1
N$48: JP1.5 JP5.5 R54.1
N$49: JP1.7 JP5.7 R55.1
N$50: JP1.9 JP5.9 R59.2
N$51: JP1.15 JP5.15 R56.2
N$52: JP1.13 JP5.13 R57.2
N$53: JP1.11 JP5.11 R58.2
N$54: JP1.16 JP5.16 R63.2
N$55: JP1.10 JP5.10 R60.2
N$56: JP1.12 JP5.12 R61.2
N$57: JP1.14 JP5.14 R62.2
N$58: JP1.8 JP5.8 R64.1
N$59: JP1.6 JP5.6 R65.1
N$60: JP1.4 JP5.4 R66.1
N$61: JP1.2 JP5.2 R67.1
N$62: JP2.1 JP6.1 R68.1
N$63: JP2.3 JP6.3 R69.2
N$64: JP2.4 JP6.4 R70.2
N$65: JP2.2 JP6.2 R71.1
PWDN1: R52.2 ; also sheet 5
PWDN2: R53.2 ; also sheet 5
PWDN3: R54.2 ; also sheet 5
PWDN4: R55.2 ; also sheet 5
RX_1: JP4.1 JP8.1 ; also sheet 2
RX_1_IF+: JP3.11 JP7.11 ; also sheet 2,5
RX_1_IF-: JP3.9 JP7.9 ; also sheet 2,5
RX_2: JP4.2 JP8.2 ; also sheet 3
RX_2_IF+: JP3.7 JP7.7 ; also sheet 3,5
RX_2_IF-: JP3.5 JP7.5 ; also sheet 3,5
RX_3: JP4.3 JP8.3 ; also sheet 4
RX_3_IF+: JP3.1 JP7.1 ; also sheet 4,5
RX_3_IF-: JP3.3 JP7.3 ; also sheet 4,5
SCLK: R66.2 ; also sheet 5
SYNC_BAR: R57.1 ; also sheet 5
TEST0: R59.1 ; also sheet 5
TEST1: R58.1 ; also sheet 5

## Power pins joined to a net without a drawn wire
EXP_PAD: U1.65(EXP_PAD)

## Library data of the parts
C1-C52 = rcl:C-US: CAPACITOR, American symbol; SPICEPREFIX: C
IC1 IC6 IC8 = SamacSys_Parts:LT6230CS6#TRMPBF: LT6230 215MHz ULN SOT23 op amp Linear Technology LT6230CS6#TRMPBF Operational Amplifier, 200MHz Rail-Rail, 12 V, 5 V, 9 V, 6-Pin TSOT-23 Source: Datasheet <http://docs-emea.rs-online.com/webdocs/05b0/0900766b805b0ba3.pdf>; DESCRIPTION: LT6230 215MHz ULN SOT23 op amp Linear Technology LT6230CS6#TRMPBF Operational Amplifier, 200MHz Rail-Rail, 12 V, 5 V, 9 V, 6-Pin TSOT-23; HEIGHT: 1mm; MANUFACTURER_NAME: Linear Technology; MANUFACTURER_PART_NUMBER: LT6230CS6#TRMPBF; MOUSER_PART_NUMBER: 584-LT6230CS6#TRMPBF; MOUSER_PRICE-STOCK: https://www.mouser.com/Search/Refine.aspx?Keyword=584-LT6230CS6%23TRMPBF; RS_PART_NUMBER: 5061202P; RS_PRICE-STOCK: http://uk.rs-online.com/web/p/products/5061202P
IC2 IC5 IC7 = SamacSys_Parts:MCP4017T-104E_LT: MCP4017T-104E/LT, Digital Potentiometer 100k 128-Position Linear Serial-I2C 6-Pin SC-70 Source: Datasheet <http://ww1.microchip.com/downloads/en/DeviceDoc/22147a.pdf>; DESCRIPTION: MCP4017T-104E/LT, Digital Potentiometer 100k 128-Position Linear Serial-I2C 6-Pin SC-70; HEIGHT: 1.1mm; MANUFACTURER_NAME: Microchip; MANUFACTURER_PART_NUMBER: MCP4017T-104E/LT; MOUSER_PART_NUMBER: 579-MCP4017T104E/LT; MOUSER_PRICE-STOCK: https://www.mouser.com/Search/Refine.aspx?Keyword=579-MCP4017T104E%2FLT; RS_PART_NUMBER: 7386799P; RS_PRICE-STOCK: http://uk.rs-online.com/web/p/products/7386799P
IC3 IC9 IC10 = SamacSys_Parts:LTC6242HVCGN#PBF: LINEAR TECHNOLOGY - LTC6242HVCGN#PBF - IC, OP AMP, 18MHZ R/R, SMD, SSOP16 Source: Datasheet <http://cds.linear.com/docs/en/datasheet/624012fe.pdf>; DESCRIPTION: LINEAR TECHNOLOGY - LTC6242HVCGN#PBF - IC, OP AMP, 18MHZ R/R, SMD, SSOP16; HEIGHT: 1.75mm; MANUFACTURER_NAME: Linear Technology; MANUFACTURER_PART_NUMBER: LTC6242HVCGN#PBF; MOUSER_PART_NUMBER: 584-LTC6242HVCGN#PBF; MOUSER_PRICE-STOCK: https://www.mouser.com/Search/Refine.aspx?Keyword=584-LTC6242HVCGN%23PBF
IC4 = SamacSys_Parts:TS461CLT: Source: Datasheet <http://www.st.com/web/en/resource/technical/document/datasheet/CD00001507.pdf>; ALLIED_NUMBER: 70521210; ALLIED_PRICE-STOCK: http://www.alliedelec.com/stmicroelectronics-ts461clt/70521210/; HEIGHT: 1.45mm; MANUFACTURER_NAME: STMicroelectronics; MANUFACTURER_PART_NUMBER: TS461CLT; MOUSER_PART_NUMBER: 511-TS461CL; MOUSER_PRICE-STOCK: https://www.mouser.com/Search/Refine.aspx?Keyword=511-TS461CL; RS_PART_NUMBER: 7958505P; RS_PRICE-STOCK: http://uk.rs-online.com/web/p/products/7958505P
IC11 = SamacSys_Parts:TPS717185DSER: 150mA, High PSRR, Low Quiescent Current, Low Noise LDO Source: Datasheet <http://www.ti.com/lit/gpn/tps717>; DESCRIPTION: 150mA, High PSRR, Low Quiescent Current, Low Noise LDO; HEIGHT: mm; MANUFACTURER_NAME: Texas Instruments; MANUFACTURER_PART_NUMBER: TPS717185DSER; MOUSER_PART_NUMBER: 595-TPS717185DSER; MOUSER_PRICE-STOCK: https://www.mouser.com/Search/Refine.aspx?Keyword=595-TPS717185DSER
IC12 = SamacSys_Parts:NCP163ASN330T1G: ON SEMICONDUCTOR - NCP163ASN330T1G - Fixed LDO Voltage Regulator, 2.2V to 5.5V, 105mV drop, 3.3V/250mA out, SOT-23-5 Source: Datasheet <https://componentsearchengine.com/Datasheets/2/NCP163ASN330T1G.pdf>; DESCRIPTION: ON SEMICONDUCTOR - NCP163ASN330T1G - Fixed LDO Voltage Regulator, 2.2V to 5.5V, 105mV drop, 3.3V/250mA out, SOT-23-5; HEIGHT: 1.45mm; MANUFACTURER_NAME: ON Semiconductor; MANUFACTURER_PART_NUMBER: NCP163ASN330T1G; MOUSER_PART_NUMBER: 863-NCP163ASN330T1G; MOUSER_PRICE-STOCK: https://www.mouser.co.uk/ProductDetail/ON-Semiconductor/NCP163ASN330T1G?qs=vLWxofP3U2ykJIQb1%252BPKcA%3D%3D; RS_PART_NUMBER: 1890394; RS_PRICE-STOCK: http://uk.rs-online.com/web/p/products/1890394
JP1 JP5 = jumper:JP8Q: JUMPER
JP2 JP6 = jumper:JP2Q: JUMPER
JP3 JP7 = jumper:JP6Q: JUMPER
JP4 JP8 = jumper:JP2E: JUMPER
R1-R71 = rcl:R-US_: RESISTOR, American symbol; SPICEPREFIX: R
ST1 = ProjectLab3GavinsParts:PHOENIX_ST(2)
U1 = ADS1174IPAPT:ADS1174IPAPT: Analogue to Digital Converter, Quad, 16 bit, 52 kSPS, Single, 4.75 V, 5.25 V, HTQFP; AVAILABILITY: Unavailable; DESCRIPTION: 16 Bit Analog to Digital Converter 4 Input 1 Sigma-Delta 64-HTQFP _10x10_; MF: Texas Instruments; MP: ADS1174IPAPT; PACKAGE: HTQFP-64 Texas Instruments; PRICE: None